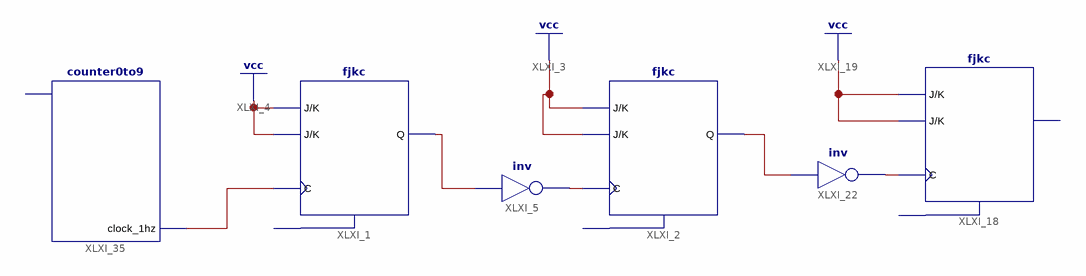
[diagram p0: schematic sheet 1]
// Xilinx ISE schematic counter.sch (spartan6) as structural Verilog: 6 symbols, 0 ports
module counter (
);

  wire XLXN_17, XLXN_26, XLXN_32, XLXN_33, XLXN_53;

  counter0to9 XLXI_35 (.clock_1hz(XLXN_53));  // open: vrclk_P123
  fjkc XLXI_1 (.C(XLXN_53), .J(1'b1), .K(1'b1), .Q(XLXN_26));  // open: CLR
  fjkc XLXI_2 (.C(XLXN_17), .J(1'b1), .K(1'b1), .Q(XLXN_33));  // open: CLR
  not XLXI_5 (XLXN_17, XLXN_26);
  fjkc XLXI_18 (.C(XLXN_32), .J(1'b1), .K(1'b1));  // open: CLR, Q
  not XLXI_22 (XLXN_32, XLXN_33);
endmodule
